# Altium project LimeSDR-Micro_1v1.PrjPcb (part 1 of 4)
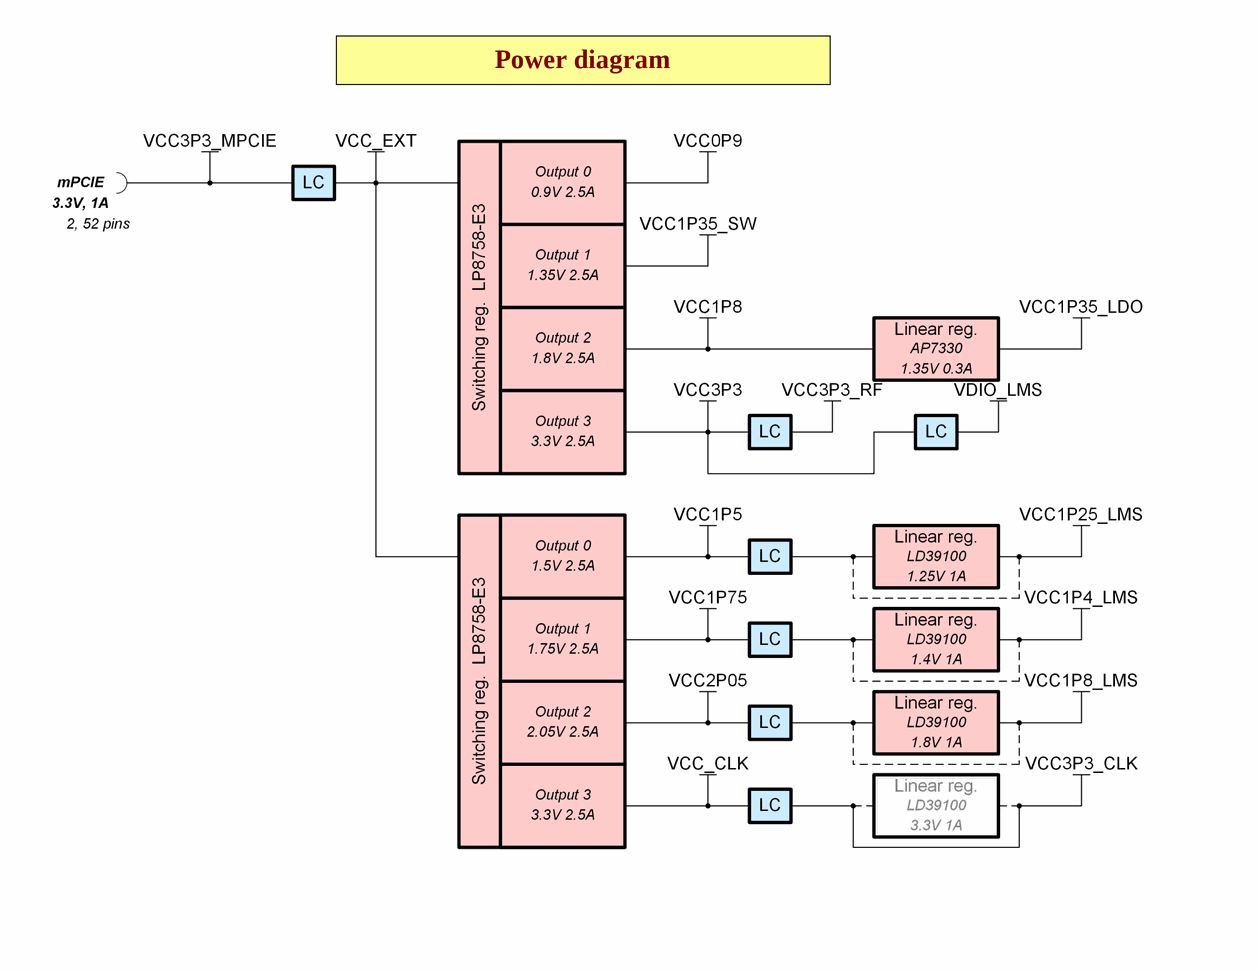
[diagram p0: 02_Power_Diagram.SchDoc, left]
3 sheets, 188 parts. Net scope: global (net labels, ports and power ports of the same name join across sheets).
Board file: LimeSDR-Micro_1v1.PcbDoc
Sheets:
  02_Power_Diagram.SchDoc
  09_Misc.SchDoc
  11_Power.SchDoc

## Sheet 02_Power_Diagram.SchDoc: Power diagram
size A4; Organization: Lime Microsystems; Address1: Surrey Tech Centre; Address2: Guildford GU2 7YG; Address3: Surrey; Address4: United Kingdom; Revision: v1.1; SheetNumber: 2; SheetTotal: 11

### Notes on the sheet
- Power diagram
- Project name:
- Title:
- Size:
- Date:
- A4
- Revision:
- Time:
- Sheet
- of
- File:

## Sheet 09_Misc.SchDoc: Misc
size A3; Organization: Lime Microsystems; Address1: Surrey Tech Centre; Address2: Guildford GU2 7YG; Address3: Surrey; Address4: United Kingdom; Revision: v1.1; SheetNumber: 9; SheetTotal: 11
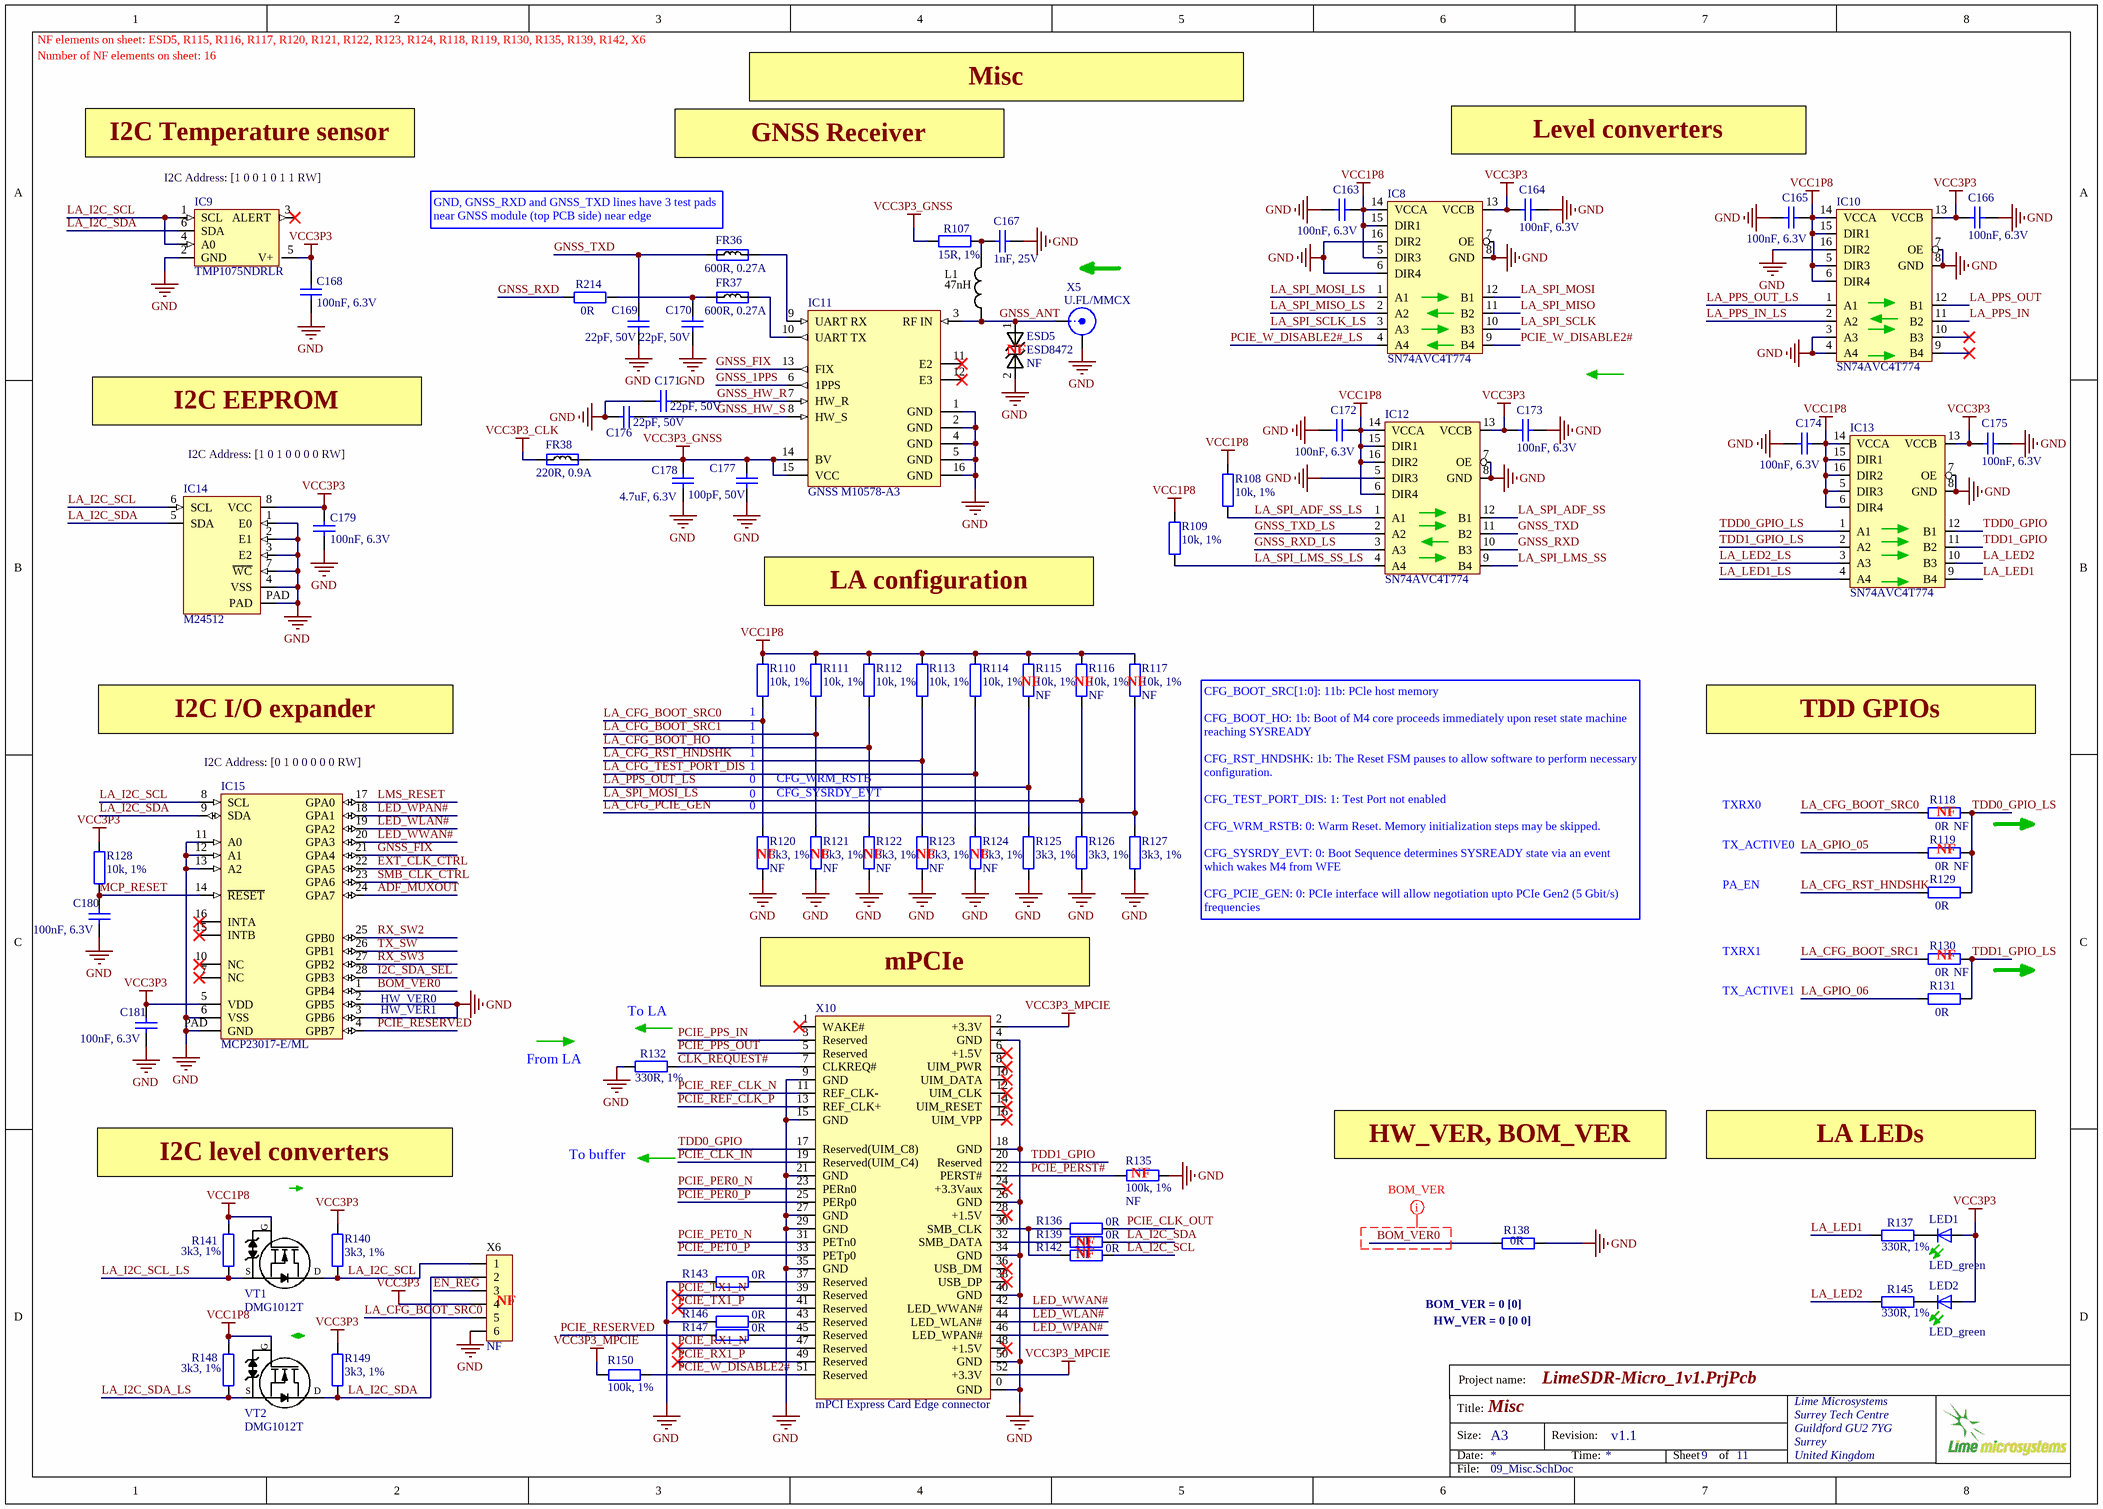
[diagram p1: 09_Misc.SchDoc]

### Parts
C163  100nF, 6.3V  [CAP0201]
C164  100nF, 6.3V  [CAP0201]
C165  100nF, 6.3V  [CAP0201]
C166  100nF, 6.3V  [CAP0201]
C167  1nF, 25V  [CAP0201]
C168  100nF, 6.3V  [CAP0201]
C169  22pF, 50V  [CAP0201]
C170  22pF, 50V  [CAP0201]
C171  22pF, 50V  [CAP0201]
C172  100nF, 6.3V  [CAP0201]
C173  100nF, 6.3V  [CAP0201]
C174  100nF, 6.3V  [CAP0201]
C175  100nF, 6.3V  [CAP0201]
C176  22pF, 50V  [CAP0201]
C177  100pF, 50V  [CAP0201]
C178  4.7uF, 6.3V  [CAP0402]
C179  100nF, 6.3V  [CAP0201]
C180  100nF, 6.3V  [CAP0201]
C181  100nF, 6.3V  [CAP0201]
ESD5  ESD8472  Assembly Info: NF  [ESD8472_X3DFN2]
FR36  600R, 0.27A  [RES0201]
FR37  600R, 0.27A  [RES0201]
FR38  220R, 0.9A  [RES0402]
IC8  SN74AVC4T774  [SN74AVC4T774_v1]
IC9  TMP1075NDRLR  [TMP1075NDRLR_temperature_sensor_SOT563]
IC10  SN74AVC4T774  [SN74AVC4T774_v1]
IC11  GNSS M10578-A3  [M10578-A3_v2]
IC12  SN74AVC4T774  [SN74AVC4T774_v1]
IC13  SN74AVC4T774  [SN74AVC4T774_v1]
IC14  M24512  [M24128-DFMC6TG]
IC15  MCP23017-E/ML  [MCP23017-E/ML_QFN28]
L1  47nH  [RES0402]
LED1  LED_green  [LED0201]
LED2  LED_green  [LED0201]
R107  15R, 1%  [RES0201]
R108  10k, 1%  [RES0201]
R109  10k, 1%  [RES0201]
R110  10k, 1%  [RES0201]
R111  10k, 1%  [RES0201]
R112  10k, 1%  [RES0201]
R113  10k, 1%  [RES0201]
R114  10k, 1%  [RES0201]
R115  10k, 1%  Assembly Info: NF  [RES0201]
R116  10k, 1%  Assembly Info: NF  [RES0201]
R117  10k, 1%  Assembly Info: NF  [RES0201]
R118  0R  Assembly Info: NF  [RES0201]
R119  0R  Assembly Info: NF  [RES0201]
R120  3k3, 1%  Assembly Info: NF  [RES0201]
R121  3k3, 1%  Assembly Info: NF  [RES0201]
R122  3k3, 1%  Assembly Info: NF  [RES0201]
R123  3k3, 1%  Assembly Info: NF  [RES0201]
R124  3k3, 1%  Assembly Info: NF  [RES0201]
R125  3k3, 1%  [RES0201]
R126  3k3, 1%  [RES0201]
R127  3k3, 1%  [RES0201]
R128  10k, 1%  [RES0201]
R129  0R  [RES0201]
R130  0R  Assembly Info: NF  [RES0201]
R131  0R  [RES0201]
R132  330R, 1%  [RES0201]
R135  100k, 1%  Assembly Info: NF  [RES0201]
R136  0R  [RES0201]
R137  330R, 1%  [RES0201]
R138  0R  [RES0201]
R139  0R  Assembly Info: NF  [RES0201]
R140  3k3, 1%  [RES0201]
R141  3k3, 1%  [RES0201]
R142  0R  Assembly Info: NF  [RES0201]
R143  0R  [RES0201]
R145  330R, 1%  [RES0201]
R146  0R  [RES0201]
R147  0R  [RES0201]
R148  3k3, 1%  [RES0201]
R149  3k3, 1%  [RES0201]
R150  100k, 1%  [RES0201]
R214  0R  [RES0201]
VT1  DMG1012T  [SOT523]
VT2  DMG1012T  [SOT523]
X5  U.FL/MMCX  [MMCX_UFL_conn_u_v2]
X6  Assembly Info: NF  [Molex_0788641001_spring_contacts]  (hidden comment: Molex 0788641001)
X10  mPCI Express Card Edge connector  [PCIe_MiniCard]  (no BOM)

### Nets
GND: C163.1 C164.2 C165.1 C166.2 C167.2 C168.2 C169.2 C170.2 C171.2 C172.1 C173.2 C174.1 C175.2 C176.2 C177.1 C178.1 C179.2 C180.2 C181.2 ESD5.2 IC8.6(DIR4) IC8.7(OE) IC8.8(GND) IC8.16(DIR2) IC9.2(GND) IC10.3(A3) IC10.4(A4) IC10.7(OE) IC10.8(GND) IC10.16(DIR2) IC11.1(GND) IC11.2(GND) IC11.4(GND) IC11.5(GND) IC11.16(GND) IC12.5(DIR3) IC12.7(OE) IC12.8(GND) IC13.7(OE) IC13.8(GND) IC14.1(E0) IC14.2(E1) IC14.3(E2) IC14.4(VSS) IC14.7(~{WC}) IC14.PAD IC15.2(GPB5) IC15.3(GPB6) IC15.6(VSS) IC15.11(A0) IC15.12(A1) IC15.13(A2) IC15.PAD(GND) R120.2 R121.2 R122.2 R123.2 R124.2 R125.2 R126.2 R127.2 R132.2 R135.1 R138.2 R143.1 R146.1 X5.2(Y) X6.6 X10.0(GND) X10.4(GND) X10.9(GND) X10.15(GND) X10.18(GND) X10.21(GND) X10.26(GND) X10.27(GND) X10.29(GND) X10.34(GND) X10.35(GND) X10.40(GND) X10.50(GND)
VCC1P8: C163.2 C165.2 C172.2 C174.2 IC8.5(DIR3) IC8.14(VCCA) IC8.15(DIR1) IC10.5(DIR3) IC10.6(DIR4) IC10.14(VCCA) IC10.15(DIR1) IC12.6(DIR4) IC12.14(VCCA) IC12.15(DIR1) IC12.16(DIR2) IC13.5(DIR3) IC13.6(DIR4) IC13.14(VCCA) IC13.15(DIR1) IC13.16(DIR2) R108.1 R109.1 R110.1 R111.1 R112.1 R113.1 R114.1 R115.1 R116.1 R117.1 R141.1 R148.1 VT1.G VT2.G
VCC3P3: C164.1 C166.1 C168.1 C173.1 C175.1 C179.1 C181.1 IC8.13(VCCB) IC9.5(V+) IC10.13(VCCB) IC12.13(VCCB) IC13.13(VCCB) IC14.8(VCC) IC15.5(VDD) LED1.A LED2.A R128.1 R140.1 R149.1 X6.4
VCC3P3_CLK: FR38.1
VCC3P3_GNSS: C177.2 C178.2 FR38.2 IC11.14(BV) IC11.15(VCC) R107.2
VCC3P3_MPCIE: R150.2 X10.2(+3.3V) X10.52(+3.3V)
ADF_MUXOUT: IC15.24(GPA7)
BOM_VER0: IC15.1(GPB4) R138.1
CLK_REQUEST#: R132.1 X10.7(CLKREQ#)
EN_REG: X6.3
EXT_CLK_CTRL: IC15.22(GPA5)
GNSS_1PPS: IC11.6(1PPS)
GNSS_ANT: ESD5.1 IC11.3(RF_IN) L1.1 X5.1(X)
GNSS_FIX: IC11.13(FIX) IC15.21(GPA4)
GNSS_HW_R: C171.1 IC11.7(HW_R)
GNSS_HW_S: C176.1 IC11.8(HW_S)
GNSS_RXD: IC12.10(B3) R214.1
GNSS_RXD_LS: IC12.3(A3)
GNSS_TXD: C169.1 FR36.1 IC12.11(B2)
GNSS_TXD_LS: IC12.2(A2)
I2C_SDA_SEL: IC15.28(GPB3)
LA_CFG_BOOT_HO: R112.2 R122.1
LA_CFG_BOOT_SRC0: R110.2 R118.1 R120.1 X6.5
LA_CFG_BOOT_SRC1: R111.2 R121.1 R130.1
LA_CFG_PCIE_GEN: R117.2 R127.1
LA_CFG_RST_HNDSHK: R113.2 R123.1 R129.1
LA_CFG_TEST_PORT_DIS: R114.2 R124.1
LA_GPIO_05: R119.1
LA_GPIO_06: R131.1
LA_I2C_SCL: IC9.1(SCL) IC9.4(A0) IC14.6(SCL) IC15.8(SCL) R140.2 R142.2 VT1.D X6.1
LA_I2C_SCL_LS: R141.2 VT1.S
LA_I2C_SDA: IC9.6(SDA) IC14.5(SDA) IC15.9(SDA) R139.2 R149.2 VT2.D X6.2
LA_I2C_SDA_LS: R148.2 VT2.S
LA_LED1: IC13.9(B4) R137.2
LA_LED1_LS: IC13.4(A4)
LA_LED2: IC13.10(B3) R145.2
LA_LED2_LS: IC13.3(A3)
LA_PPS_IN: IC10.11(B2)
LA_PPS_IN_LS: IC10.2(A2)
LA_PPS_OUT: IC10.12(B1)
LA_PPS_OUT_LS: IC10.1(A1) R115.2 R125.1
LA_SPI_ADF_SS: IC12.12(B1)
LA_SPI_ADF_SS_LS: IC12.1(A1) R108.2
LA_SPI_LMS_SS: IC12.9(B4)
LA_SPI_LMS_SS_LS: IC12.4(A4) R109.2
LA_SPI_MISO: IC8.11(B2)
LA_SPI_MISO_LS: IC8.2(A2)
LA_SPI_MOSI: IC8.12(B1)
LA_SPI_MOSI_LS: IC8.1(A1) R116.2 R126.1
LA_SPI_SCLK: IC8.10(B3)
LA_SPI_SCLK_LS: IC8.3(A3)
LED_WLAN#: IC15.19(GPA2) X10.44(LED_WLAN#)
LED_WPAN#: IC15.18(GPA1) X10.46(LED_WPAN#)
LED_WWAN#: IC15.20(GPA3) X10.42(LED_WWAN#)
LMS_RESET: IC15.17(GPA0)
MCP_RESET: C180.1 IC15.14(~{RESET}) R128.2
PCIE_CLK_IN: X10.19(Reserved(UIM_C4))
PCIE_CLK_OUT: R136.2
PCIE_PER0_N: X10.23(PERn0)
PCIE_PER0_P: X10.25(PERp0)
PCIE_PERST#: R135.2 X10.22(PERST#)
PCIE_PET0_N: X10.31(PETn0)
PCIE_PET0_P: X10.33(PETp0)
PCIE_PPS_IN: X10.3(Reserved)
PCIE_PPS_OUT: X10.5(Reserved)
PCIE_REF_CLK_N: X10.11(REF_CLK-)
PCIE_REF_CLK_P: X10.13(REF_CLK+)
PCIE_RESERVED: IC15.4(GPB7) R147.1
PCIE_RX1_N: X10.47(Reserved)
PCIE_RX1_P: X10.49(Reserved)
PCIE_TX1_N: X10.39(Reserved)
PCIE_TX1_P: X10.41(Reserved)
PCIE_W_DISABLE2#: IC8.9(B4) R150.1 X10.51(Reserved)
PCIE_W_DISABLE2#_LS: IC8.4(A4)
RX_SW2: IC15.25(GPB0)
RX_SW3: IC15.27(GPB2)
SMB_CLK_CTRL: IC15.23(GPA6)
TDD0_GPIO: IC13.12(B1) X10.17(Reserved(UIM_C8))
TDD0_GPIO_LS: IC13.1(A1) R118.2 R119.2 R129.2
TDD1_GPIO: IC13.11(B2) X10.20(Reserved)
TDD1_GPIO_LS: IC13.2(A2) R130.2 R131.2
TX_SW: IC15.26(GPB1)
NetC167_1: C167.1 L1.2 R107.1
NetC170_1: C170.1 FR37.1 R214.2
NetFR36_2: FR36.2 IC11.9(UART_RX)
NetFR37_2: FR37.2 IC11.10(UART_TX)
NetLED1_K: LED1.K(C) R137.1
NetLED2_K: LED2.K(C) R145.1
NetR136_1: R136.1 R142.1 X10.30(SMB_CLK)
NetR139_1: R139.1 X10.32(SMB_DATA)
NetR143_2: R143.2 X10.37(Reserved)
NetR146_2: R146.2 X10.43(Reserved)
NetR147_2: R147.2 X10.45(Reserved)

Not connected (* = marked no-connect by the designer): IC9 3(ALERT)*; IC10 9(B4)* 10(B3)*; IC11 11(E2)* 12(E3)*; IC15 7(NC)* 10(NC)* 15(INTB)* 16(INTA)*; X10 1(WAKE#)* 6(+1.5V)* 8(UIM_PWR)* 10(UIM_DATA)* 12(UIM_CLK)* 14(UIM_RESET)* 16(UIM_VPP)* 24(+3.3Vaux)* 28(+1.5V)* 36(USB_DM)* 38(USB_DP)* 48(+1.5V)*

### Layout directives
net class BOM_VER: BOM_VER0

### Notes on the sheet
- NF elements on sheet: ESD5, R115, R116, R117, R120, R121, R122, R123, R124, R118, R119, R130, R135, R139, R142, X6
- Number of NF elements on sheet: 16
- Misc
- I2C Temperature sensor
- (near IC9) I2C Address: [1 0 0 1 0 1 1 RW]
- GNSS Receiver
- Level converters
- (near FR36) GND, GNSS_RXD and GNSS_TXD lines have 3 test pads near GNSS module (top PCB side) near edge
- (near ESD5) NF
- I2C EEPROM
- I2C Address: [1 0 1 0 0 0 0 RW]
- LA configuration
- (near R110) 1
- (near R115) NF
- (near R116) NF
- (near R117) NF
- I2C I/O expander
- (near IC15) I2C Address: [0 1 0 0 0 0 0 RW]
- 1
- 0
- CFG_WRM_RSTB
- TDD GPIOs
- (near R120) 0
- CFG_SYSRDY_EVT
- TXRX0
- TX_ACTIVE0
- (near R118) NF
- (near R119) NF
- (near R120) NF
- (near R121) NF
- (near R122) NF
- (near R123) NF
- (near R124) NF
- CFG_BOOT_SRC[1:0]: 11b: PCle host memory
  CFG_BOOT_HO: 1b: Boot of M4 core proceeds immediately upon reset state machine reaching SYSREADY
  CFG_RST_HNDSHK: 1b: The Reset FSM pauses to allow software to perform necessary configuration.
  CFG_TEST_PORT_DIS: 1: Test Port not enabled
  CFG_WRM_RSTB: 0: Warm Reset. Memory initialization steps may be skipped.
  CFG_SYSRDY_EVT: 0: Boot Sequence determines SYSREADY state via an event which wakes M4 from WFE
  CFG_PCIE_GEN: 0: PCIe interface will allow negotiation upto PCIe Gen2 (5 Gbit/s) frequencies
- PA_EN
- (near X10) mPCIe
- TXRX1
- (near R130) NF
- (near IC15) HW_VER0
- (near IC15) HW_VER1
- (near R132) To LA
- TX_ACTIVE1
- From LA
- I2C level converters
- To buffer
- (near R135) NF
- HW_VER, BOM_VER
- LA LEDs
- NF
- (near X6) NF
- BOM_VER = 0 [0]
- HW_VER = 0 [0 0]
- Project name:
- Title:
- Size:
- Date:
- A3
- Revision:
- Time:
- Sheet
- of
- File:

### Library data of the parts
C163-C166 C168 C172-C175 C179-C181 = Cap_0402: Part Description: 0.1 µF ±20% 10V Ceramic Capacitor X5R 0201 (0603 Metric); Manufacturer: Samsung; Manufacturer Part Number 1: CL03A104MP3NNNC; Tolerance: 20%; Voltage Rating (DC): 10V; Value: 100nF, 6.3V; Capacitance: 100nF; Case/Package: 0201; Case Code (Imperial): 0201; Case Code (Metric): 0603; ComponentLink5Description: https://datasheet.ciiva.com/25788/cl03a104mp3nnnc-25788272.pdf?src-supplier=Digi-Key; ComponentLink5URL: https://datasheet.ciiva.com/25788/cl03a104mp3nnnc-25788272.pdf?src-supplier=Digi-Key; Length: 0.024inch; Max Operating Temperature: 85°C; Min Operating Temperature: -55°C; Mount: Surface Mount; Package Quantity: 1; Packaging: Tape and Reel; Pricing 1: 1=0,10000, 10=0,03000, 50=0,01640, 100=0,01330, 500=0,00950, 1000=0,00747, 2500=0,00679, 5000=0,00625 (USD); RoHS: Yes; RoHS Compliant: Yes; Series: CL; Stock 1: 3817176; Supplier 1: Digi-Key; Supplier Part Number 1: 1276-1321-1-ND; Thickness: 0.013inch; Voltage Rating: 10V; Width: 0.012inch
C167 = Cap_0402: Manufacturer Part Number 1: C0603X7R1E102K030BA; Manufacturer: TDK Corporation; Part Description: 1000pF ±10% 25V X7R Ceramic Capacitor -55°C ~ 125°C Surface Mount, MLCC 0201 (0603 Metric) 0.024" L x 0.012" W (0.60mm x 0.30mm); Temperature Coefficient: X7R; Tolerance: ±10%; Capacitance: 1000pF; Value: 1nF, 25V; Supplier 1: Digi-Key; Supplier Part Number 1: 445-7275-1-ND; Voltage - Rated: 25V; Features: -; Package / Case: 0201 (0603 Metric); Lead Spacing: -; Mounting Type: Surface Mount, MLCC; Lead Style: -; Height - Seated (Max): -; Operating Temperature: -55°C ~ 125°C; Size / Dimension: 0.024" L x 0.012" W (0.60mm x 0.30mm); Applications: General Purpose; Ratings: -; Thickness (Max): 0.013" (0.33mm); RoHS: RoHS Compliant; Packaging: Cut Tape (CT); Category: Capacitors
C169-C171 C176 = Cap_0402: Manufacturer: Murata; Manufacturer Part Number 1: GRM0335C1H220JA01D; Part Description: 22 pF ±5% 50V Ceramic Capacitor C0G, NP0 0201 (0603 Metric); Tolerance: 5%; Dielectric: C0G; Value: 22pF, 50V; Supplier 1: Digi-Key; Supplier Part Number 1: 490-6123-1-ND; Stock 1: 2966748; Pricing 1: 1=0,10000, 10=0,01300, 50=0,00720, 100=0,00590, 500=0,00424, 1000=0,00333, 2500=0,00303, 5000=0,00279 (USD); RoHS: Yes; Mount: Surface Mount; Case/Package: 0201; Case Code (Metric): 0603; Case Code (Imperial): 0201; Min Operating Temperature: -55°C; Max Operating Temperature: 125°C; Package Quantity: 15000; Capacitance: 22pF; Voltage Rating: 50V; Packaging: Tape and Reel; Termination: SMD/SMT; Voltage: 50V; Voltage Rating (DC): 50V; Series: GRM; Length: 0.6mm; Width: 0.012inch; Height: 0.3mm; Thickness: 0.013inch; Depth: 0.3mm; Lead Free: Lead Free; RoHS Compliant: Yes; ComponentLink1URL: https://datasheet.ciiva.com/6271/partnumbering-e-01-6271146.pdf?src-supplier=Digi-Key; ComponentLink1Description: https://datasheet.ciiva.com/6271/partnumbering-e-01-6271146.pdf?src-supplier=Digi-Key; ComponentLink2URL: https://datasheet.ciiva.com/6271/partnumbering-e-01-6271143.pdf?src-supplier=Digi-Key; ComponentLink2Description: https://datasheet.ciiva.com/6271/partnumbering-e-01-6271143.pdf?src-supplier=Digi-Key; ComponentLink3URL: https://datasheet.ciiva.com/6271/partnumbering-e-01-6271149.pdf?src-supplier=Digi-Key; ComponentLink3Description: https://datasheet.ciiva.com/6271/partnumbering-e-01-6271149.pdf?src-supplier=Digi-Key
C177 = Cap_0402: Part Description: 100 pF ±5% 50V Ceramic Capacitor C0G, NP0 0201 (0603 Metric); Manufacturer: TDK; Manufacturer Part Number 1: C0603C0G1H101J030BA; Dielectric: C0G; Dielectric Material: Ceramic; Insulation Resistance: 10GR; Tolerance: 5%; Value: 100pF, 50V; Capacitance: 100pF; Case/Package: 0201; Case Code (Imperial): 0201; Case Code (Metric): 0603; ComponentLink1Description: https://datasheet.ciiva.com/24217/c0603c0g1h101j030ba-264106-24217425.pdf?src-supplier=Mouser; ComponentLink1URL: https://datasheet.ciiva.com/24217/c0603c0g1h101j030ba-264106-24217425.pdf?src-supplier=Mouser; ComponentLink2Description: https://datasheet.ciiva.com/16205/mlcc-commercial-general-en-16205590.pdf?src-supplier=Future+Electronics; ComponentLink2URL: https://datasheet.ciiva.com/16205/mlcc-commercial-general-en-16205590.pdf?src-supplier=Future+Electronics; ComponentLink3Description: https://datasheet.ciiva.com/6250/tdkmlcccaprange-6250351.pdf?src-supplier=Digi-Key; ComponentLink3URL: https://datasheet.ciiva.com/6250/tdkmlcccaprange-6250351.pdf?src-supplier=Digi-Key; Construction: Flat; Depth: 0.3mm; Height: 0.3mm; Lead Free: Lead Free; Length: 0.6mm; Max Operating Temperature: 125°C; Min Operating Temperature: -55°C; Mount: Surface Mount; Number of Pins: 2; Package Quantity: 1; Packaging: Tape and Reel; Pricing 1: 1=0,10000, 10=0,06000, 50=0,03280, 100=0,02670, 500=0,01908, 1000=0,01500, 2500=0,01364, 5000=0,01254 (USD); Reach SVHC Compliant: Yes; RoHS: Yes; RoHS Compliant: Yes; Series: C; Stock 1: 367528; Supplier 1: Digi-Key; Supplier Part Number 1: 445-1786-1-ND; Termination: SMD/SMT; Thickness: 0.013inch; Voltage: 50V; Voltage Rating (DC): 50V; Voltage Rating: 50V; Weight: 6E-06oz; Width: 0.012inch
C178 = Cap_0402: Manufacturer: Murata Electronics North America; Manufacturer Part Number 1: GRM155R60J475ME87D; Part Description: 4.7µF ±20% 6.3V X5R Ceramic Capacitor -55°C ~ 85°C Surface Mount, MLCC 0402 (1005 Metric) 0.039" L x 0.020" W (1.00mm x 0.50mm); Tolerance: ±20%; Capacitance: 4.7µF; Temperature Coefficient: X5R; Lead Style: -; Ratings: -; Height - Seated (Max): -; Thickness (Max): 0.022" (0.55mm); Voltage - Rated: 6.3V; Packaging: Cut Tape (CT); Lead Spacing: -; Category: Capacitors; Supplier Part Number 1: 490-5408-1-ND; Applications: General Purpose; Operating Temperature: -55°C ~ 85°C; Mounting Type: Surface Mount, MLCC; Features: Derating Recommended; RoHS: RoHS Compliant; Supplier 1: Digi-Key; Package / Case: 0402 (1005 Metric); Size / Dimension: 0.039" L x 0.020" W (1.00mm x 0.50mm); Value: 4.7uF, 6.3V
ESD5 = ESD8472: Manufacturer: ON Semiconductor; Manufacturer Part Number 1: ESD8472MUT5G; Part Description: TVS DIODE 5.3VWM 14VC X3DFN2; Voltage - Reverse Standoff (Typ): 5.3V (Max); Voltage - Breakdown (Min): 7V; Voltage - Clamping (Max) @ Ipp: 14V; Current - Peak Pulse (10/1000µs): 3A (8/20µs); Power Line Protection: No; Capacitance @ Frequency: 0.2pF @ 1MHz; Supplier 1: Digi-Key; RoHS: RoHS Compliant; Category: Circuit Protection; Stock 1: 2295; Pricing 1: 1=0.39, 10=0.315, 100=0.2142, 500=0.16068, 1000=0.12051 (USD); Packaging: Cut Tape (CT); Part Status: Active; Type: Zener; Power - Peak Pulse: -; Applications: Automotive, RF Antenna; Operating Temperature: -55°C ~ 150°C (TJ); Mounting Type: Surface Mount; Package / Case: 2-XFDFN; Supplier Device Package: 2-X3DFN (0.62x0.32); ComponentLink1URL: http://www.onsemi.com/pub/Collateral/ESD8472-D.PDF; ComponentLink1Description: http://www.onsemi.com/pub/Collateral/ESD8472-D.PDF; Supplier Part Number 1: ESD8472MUT5GOSCT-ND
FR36 FR37 = Ferrite: Manufacturer Part Number 1: BK0603TS601-T; Manufacturer: Taiyo Yuden; Part Description: FERRITE BEAD 600 OHM 0201 1LN; DC Resistance (DCR): 750 mOhm Max; Filter Type: Differential Mode - Single; Impedance @ Frequency: 600 Ohm @ 100MHz; Current Rating: 270mA; Value: 600R@100MHz; Supplier 1: Digi-Key; Supplier Part Number 1: 587-3277-1-ND; Size / Dimension: 0.024" L x 0.012" W (0.60mm x 0.30mm); Package / Case: 0201 (0603 Metric); Height (Max): 0.013" (0.33mm); Mounting Type: Surface Mount; Packaging: Cut Tape (CT); RoHS: RoHS Compliant; Category: Filters
FR38 = Ferrite: Manufacturer: TDK Corporation; Manufacturer Part Number 1: MPZ1005S221ET000; Part Description: FERRITE BEAD 220 OHM 0402 1LN; Impedance @ Frequency: 220 Ohm @ 100MHz; Current Rating: 900mA; DC Resistance (DCR): 220 mOhm Max; Supplier 1: Digi-Key; Package / Case: 0402 (1005 Metric); Category: Filters; Supplier Part Number 1: 445-9329-2-ND; Value: 220R, 0.9A
IC8 IC10 IC12 IC13 = SN74AVC4T774: Manufacturer: Texas Instruments; Manufacturer Part Number 1: SN74AVC4T774RSVR; Part Description: Voltage Level Translator Bidirectional 1 Circuit 4 Channel 380Mbps 16-UQFN (2.6x1.8); Logic Function: Translator, Bidirectional, 3-State; Differential - Input:Output: No/No; Propagation Delay (Max): 2.4ns; Number of Bits: 4; Number of Outputs/Channel: 1; Input Type: Logic; Voltage - Supply: 1.2 V ~ 3.6 V; Data Rate: 380Mbps; Supplier 1: Digi-Key; Supplier Device Package: 16-UQFN (2.6x1.8); Packaging: Digi-Reel®; Category: Integrated Circuits (ICs); Mounting Type: Surface Mount; RoHS: RoHS Compliant; Number of Channels: 4; Output Type: Logic; Package / Case: 16-UFQFN; Operating Temperature: -40°C ~ 85°C; Supplier Part Number 1: 296-24741-6-ND
IC9 = TMP1075NDRLR_temperature_sensor: Part Description: Temperature Sensor Digital, Local -40°C ~ 125°C 12 b SOT-563; Manufacturer: Texas Instruments; Supplier 1: Digi-Key; Supplier Part Number 1: 296-TMP1075NDRLRCT-ND; Manufacturer Part Number 1: TMP1075NDRLR; Stock 1: 3405; Pricing 1: 1=0,67000, 5=0,63800, 10=0,55500, 25=0,48760, 50=0,40500, 100=0,34500, 500=0,30000, 1000=0,26250 (USD); RoHS: No; RoHS Compliant: Yes
IC11 = M10578-A3_GPS_GNSS: Manufacturer: Antenova; Part Description: RADIONOVA RF Receiver GPS 1.575GHz -165dBm Module; Frequency: 1.575GHz; Sensitivity: -165dBm; Modulation or Protocol: GPS; Current - Receiving: 28mA; Data Interface: UART; Voltage - Supply: 3.3V; Supplier 1: Digi-Key; Manufacturer Part Number 1: M10578-A3; RoHS: RoHS Compliant; Category: RF/IF and RFID; Stock 1: 0; Pricing 1: 1=17.75, 10=16.061, 25=14.7928, 100=13.5248, 250=12.67952, 500=11.8342 (USD); Packaging: Cut Tape (CT); Part Status: Active; Data Rate (Max): -; Applications: General Purpose; Memory Size: -; Antenna Connector: -; Features: -; Operating Temperature: -40°C ~ 85°C; Package / Case: Module; Supplier Device Package: Module; ComponentLink1URL: http://www.antenova-m2m.com/wp-content/uploads/2015/12/GPS_Radionova_M10578-A3-PS-1.0.pdf; ComponentLink1Description: http://www.antenova-m2m.com/wp-content/uploads/2015/12/GPS_Radionova_M10578-A3-PS-1.0.pdf; Supplier Part Number 1: 627-1074-1-ND
IC14 = M24128-DFMC6TG: Part Description: IC EEPROM 512KBIT I2C 8UFDFPN; Manufacturer: STMicroelectronics; Manufacturer Part Number 1: M24512-DFMC6TG; ComponentLink1URL: http://www.st.com/content/ccc/resource/technical/document/datasheet/59/05/c9/5b/7b/41/48/b6/CD00259167.pdf/files/CD00259167.pdf/jcr:content/translations/en.CD00259167.pdf; ComponentLink1Description: http://www.st.com/content/ccc/resource/technical/document/datasheet/59/05/c9/5b/7b/41/48/b6/CD00259167.pdf/files/CD00259167.pdf/jcr:content/translations/en.CD00259167.pdf; Supplier 1: Digi-Key; Supplier Part Number 1: 497-15745-1-ND; Stock 1: 12789; Pricing 1: 1=1,03, 10=0,935, 25=0,9232, 50=0,9178, 100=0,8206, 250=0,81368, 500=0,80166, 1000=0,77298 (USD); RoHS: Yes; ComponentLink2URL: https://datasheet.ciiva.com/29611/cd00251873-29611552.pdf?src-supplier=Digi-Key; ComponentLink2Description: https://datasheet.ciiva.com/29611/cd00251873-29611552.pdf?src-supplier=Digi-Key
IC15 = MCP23017-E/ML_I2C_expander: Part Description: I/O Expander 16 I²C 1.7 MHz 28-QFN (6x6); Manufacturer: Microchip; ComponentLink1URL: https://datasheet.ciiva.com/1496/12179-1496011.pdf?src-supplier=Element14; ComponentLink1Description: https://datasheet.ciiva.com/1496/12179-1496011.pdf?src-supplier=Element14; ComponentLink2URL: https://datasheet.ciiva.com/1780/21952b-1780121.pdf?src-supplier=Digi-Key; ComponentLink2Description: https://datasheet.ciiva.com/1780/21952b-1780121.pdf?src-supplier=Digi-Key; ComponentLink3URL: https://datasheet.ciiva.com/3149/21952b-3149158.pdf?src-supplier=Avnet; ComponentLink3Description: https://datasheet.ciiva.com/3149/21952b-3149158.pdf?src-supplier=Avnet; ComponentLink4URL: https://datasheet.ciiva.com/16222/filehandler-aspxddocname-en023709-16222331.pdf?src-supplier=Future+Electronics; ComponentLink4Description: https://datasheet.ciiva.com/16222/filehandler-aspxddocname-en023709-16222331.pdf?src-supplier=Future+Electronics; Supplier 1: Digi-Key; Supplier Part Number 1: MCP23017-E/ML-ND; Manufacturer Part Number 1: MCP23017-E/ML; Stock 1: 3965; Pricing 1: 1=1,9, 25=1,59, 100=1,44 (USD); RoHS: Yes
L1 = Inductor_0603: Manufacturer: COILCRAFT; Manufacturer Part Number: 0402HP-47NXJLU; Part Description: INDUCTOR, RF, 47NH, 5%, 2.4GHZ, SMD; Product Range:0402HP Series; Inductance:47nH; Inductance Tolerance:± 5%; High Frequency Inductor Case:0402 [1005 Metric]; Self Resonant Frequency Min:2.4GHz; DC Resistance Max:0.58ohm; DC Current Rating:420mA; SVHC: No SVHC (15-Jun-2015); Inductance Tolerance: ± 5%; High Frequency Inductor Case: 0402 [1005 Metric]; Inductance: 47; DC Resistance Max: 0.58; Self Resonant Frequency Min: 2.4; Product Range: 0402; DC Current Rating: 420; Inductor Construction: Wirewound; Supplier 1: Farnell; Supplier Part Number 1: 2285856; Packaging: Cut Tape; Inductor Case Style: 0402 [1005 Metric]; RoHS: Y-EX; value: 47nH; Manufacturer Part Number 1: 0402HP-47NXJLU
LED1 LED2 = LED_green: Part Description: Green 571nm LED Indication - Discrete 1.97V 2-SMD, 0201; Manufacturer: Kingbright; Manufacturer Part Number 1: APG0603CGC-TT; Color: Green; Lens Color: Colorless; Lens Transparency: Clear; Luminous Intensity: 15mcd; Test Current: 10mA; Viewing Angle: 140°; Dominant Wavelength: 571nm; Forward Voltage: 1.97V; ComponentLink1URL: http://www.kingbrightusa.com/images/catalog/SPEC/APG0603CGC-TT.pdf?src-supplier=Digi-Key; ComponentLink1Description: http://www.kingbrightusa.com/images/catalog/SPEC/APG0603CGC-TT.pdf?src-supplier=Digi-Key; Supplier 1: Digi-Key; Supplier Part Number 1: 754-2021-1-ND; Stock 1: 18826; Pricing 1: 1=0,50000, 10=0,30500, 100=0,17530, 1000=0,13720, 2000=0,12577 (USD); RoHS: Yes; Mount: Surface Mount; Case/Package: SMD/SMT; Packaging: Tape and Reel; Length: 0.65mm; Width: 0.35mm; Height: 0.25mm; Lead Free: Lead Free; RoHS Compliant: Yes
R107 = Res_0402: Manufacturer: Yageo; Manufacturer Part Number 1: RC0201FR-0715RL; Part Description: 15 Ohms ±1% 0.05W, 1/20W Chip Resistor 0201 (0603 Metric) Moisture Resistant Thick Film; Power Rating: 50mW; Voltage Rating: 25V; Temperature Coefficient: 200ppm/°C; Value: 15R, 1%; ComponentLink1URL: https://datasheet.ciiva.com/5924/1563626-5924912.pdf?src-supplier=Farnell; ComponentLink1Description: https://datasheet.ciiva.com/5924/1563626-5924912.pdf?src-supplier=Farnell; ComponentLink2URL: https://datasheet.ciiva.com/22661/1563626-22661319.pdf?src-supplier=Element14; ComponentLink2Description: https://datasheet.ciiva.com/22661/1563626-22661319.pdf?src-supplier=Element14; Supplier 1: Digi-Key; Supplier Part Number 1: 311-15.0MCT-ND; Stock 1: 379739; Pricing 1: 1=0,10000, 10=0,03700, 100=0,01530, 1000=0,00685, 2500=0,00595, 5000=0,00491 (USD); RoHS: Yes; Case/Package: 0201; Case Code (Imperial): 0201; Case Code (Metric): 0603; Size Code: 0201; Min Operating Temperature: -55°C; Max Operating Temperature: 125°C; Resistance: 15R; Tolerance: 1%; Packaging: Cut Tape; Package Quantity: 1; Termination: SMD/SMT; Resistor Type: Thick Film; Number of Terminations: 2; Max Power Dissipation: 50mW; Features: Moisture Resistant; Series: RC; Resistance Tolerance: 1%; Length: 0.6mm; Width: 0.3mm; Height: 0.23mm; Lead Free: Lead Free; RoHS Compliant: Yes; ComponentLink3URL: https://datasheet.ciiva.com/7672/1563626-7672202.pdf?src-supplier=Element14; ComponentLink3Description: https://datasheet.ciiva.com/7672/1563626-7672202.pdf?src-supplier=Element14; ComponentLink4URL: https://datasheet.ciiva.com/2493/pyu-r-int-thick-7-2493785.pdf?src-supplier=Digi-Key; ComponentLink4Description: https://datasheet.ciiva.com/2493/pyu-r-int-thick-7-2493785.pdf?src-supplier=Digi-Key; ComponentLink5URL: https://datasheet.ciiva.com/2493/pyu-r-int-thick-7-2493786.pdf?src-supplier=Digi-Key; ComponentLink5Description: https://datasheet.ciiva.com/2493/pyu-r-int-thick-7-2493786.pdf?src-supplier=Digi-Key; ComponentLink6URL: https://datasheet.ciiva.com/2493/pyu-r-int-thick-7-2493784.pdf?src-supplier=Digi-Key; ComponentLink6Description: https://datasheet.ciiva.com/2493/pyu-r-int-thick-7-2493784.pdf?src-supplier=Digi-Key
R108-R117 R128 = Res_0402: Manufacturer: Yageo; Manufacturer Part Number 1: RC0201FR-0710KL; Part Description: 10 kOhms ±1% 0.05W, 1/20W Chip Resistor 0201 (0603 Metric) Moisture Resistant Thick Film; Resistance: 10kR; Power Rating: 50mW; Voltage Rating: 25V; Temperature Coefficient: 200ppm/°C; Value: 10k, 1%; ComponentLink1URL: https://datasheet.ciiva.com/5924/1563626-5924912.pdf?src-supplier=Farnell; ComponentLink1Description: https://datasheet.ciiva.com/5924/1563626-5924912.pdf?src-supplier=Farnell; ComponentLink2URL: https://datasheet.ciiva.com/22661/1563626-22661319.pdf?src-supplier=Element14; ComponentLink2Description: https://datasheet.ciiva.com/22661/1563626-22661319.pdf?src-supplier=Element14; Supplier 1: Digi-Key; Supplier Part Number 1: 311-10.0KMCT-ND; Stock 1: 17142315; Pricing 1: 1=0,10000, 10=0,03700, 100=0,01530, 1000=0,00685, 2500=0,00595, 5000=0,00491 (USD); RoHS: Yes; Case/Package: 0201; Number of Pins: 2; Case Code (Imperial): 0201; Case Code (Metric): 0603; Contact Plating: Tin,Matte; Weight: 6E-06oz; Min Operating Temperature: -55°C; Max Operating Temperature: 125°C; Tolerance: 1%; Packaging: Tape and Reel; Package Quantity: 10000; Termination: SMD/SMT; Resistor Type: Thick Film; Number of Terminations: 2; Max Power Dissipation: 50mW; Voltage Rating (DC): 25V; Features: Moisture Resistant; Series: RC; Resistance Tolerance: 1%; Construction: Rectangular; Working Voltage: 25V; Technology: THICK FILM; Length: 0.6mm; Width: 0.012inch; Height: 0.01inch; Depth: 0.3mm; Radiation Hardening: No; Reach SVHC Compliant: Yes; Military Standard: Not; Lead Free: Lead Free; RoHS Compliant: Yes; ComponentLink3URL: https://datasheet.ciiva.com/7660/1421516-7660807.pdf?src-supplier=Element14; ComponentLink3Description: https://datasheet.ciiva.com/7660/1421516-7660807.pdf?src-supplier=Element14; ComponentLink4URL: https://datasheet.ciiva.com/46391/1421516-46391339.pdf?src-supplier=Element14; ComponentLink4Description: https://datasheet.ciiva.com/46391/1421516-46391339.pdf?src-supplier=Element14; ComponentLink5URL: https://datasheet.ciiva.com/2467/pyu-r-int-thick-7-2467110.pdf?src-supplier=Digi-Key; ComponentLink5Description: https://datasheet.ciiva.com/2467/pyu-r-int-thick-7-2467110.pdf?src-supplier=Digi-Key; ComponentLink6URL: https://datasheet.ciiva.com/2467/pyu-r-int-thick-7-2467111.pdf?src-supplier=Digi-Key; ComponentLink6Description: https://datasheet.ciiva.com/2467/pyu-r-int-thick-7-2467111.pdf?src-supplier=Digi-Key; ComponentLink7URL: https://datasheet.ciiva.com/2467/pyu-r-int-thick-7-2467109.pdf?src-supplier=Digi-Key; ComponentLink7Description: https://datasheet.ciiva.com/2467/pyu-r-int-thick-7-2467109.pdf?src-supplier=Digi-Key
R118 R119 R129-R131 R136 R138 R139 R142 R143 R146 R147 R214 = Res_0402: Part Description: 0 Ohms Jumper Chip Resistor 0201 (0603 Metric) Moisture Resistant Thick Film; Manufacturer: Yageo; Manufacturer Part Number 1: RC0201JR-070RL; Power Rating: 50mW; Tolerance: 5%; Voltage Rating: 25V; ComponentLink1URL: http://www.yageo.com/documents/recent/PYu-RC_Group_51_RoHS_L_7.pdf; ComponentLink1Description: http://www.yageo.com/documents/recent/PYu-RC_Group_51_RoHS_L_7.pdf; Value: 0R; Supplier 1: Digi-Key; Supplier Part Number 1: 311-0.0NCT-ND; Stock 1: 6252381; Pricing 1: 1=0,10000, 10=0,03700, 25=0,02680, 50=0,02020, 100=0,01500, 250=0,01140, 500=0,00912, 1000=0,00672, 5000=0,00482 (USD); RoHS: Yes; Case/Package: 0201; Case Code (Metric): 0603; Case Code (Imperial): 0201; Weight: 6E-06oz; Contact Plating: Tin,Matte; Size Code: 0201; Min Operating Temperature: -55°C; Max Operating Temperature: 125°C; Packaging: Tape and Reel; Resistance: 0R; Package Quantity: 1; Resistor Type: Thick Film; Number of Terminations: 2; Termination: SMD/SMT; Max Power Dissipation: 50mW; Voltage Rating (DC): 25V; Features: Moisture Resistant; Series: RC; Construction: Rectangular; Resistance Tolerance: 5%; Length: 0.024inch; Width: 0.012inch; Height: 0.01inch; Depth: 0.3mm; Radiation Hardening: No; Military Standard: Not; Lead Free: Lead Free; RoHS Compliant: Yes; ComponentLink2URL: https://datasheet.ciiva.com/7672/1563626-7672248.pdf?src-supplier=Element14; ComponentLink2Description: https://datasheet.ciiva.com/7672/1563626-7672248.pdf?src-supplier=Element14; ComponentLink3URL: https://datasheet.ciiva.com/7672/1563626-7672247.pdf?src-supplier=Element14; ComponentLink3Description: https://datasheet.ciiva.com/7672/1563626-7672247.pdf?src-supplier=Element14; ComponentLink4URL: https://datasheet.ciiva.com/7660/1421516-7660808.pdf?src-supplier=Element14; ComponentLink4Description: https://datasheet.ciiva.com/7660/1421516-7660808.pdf?src-supplier=Element14; ComponentLink5URL: https://datasheet.ciiva.com/46391/1421516-46391340.pdf?src-supplier=Element14; ComponentLink5Description: https://datasheet.ciiva.com/46391/1421516-46391340.pdf?src-supplier=Element14
R120-R127 R140 R141 R148 R149 = Res_0402: Manufacturer: Yageo; Manufacturer Part Number 1: RC0201FR-073K3L; Part Description: 3.3 kOhms ±1% 0.05W, 1/20W Chip Resistor 0201 (0603 Metric) Moisture Resistant Thick Film; Max Power Dissipation: 50mW; Resistance: 3.3kR; Temperature Coefficient: 200ppm/°C; Voltage Rating: 25V; ComponentLink1URL: http://www.yageo.com/documents/recent/PYu-RC_Group_51_RoHS_L_7.pdf; ComponentLink1Description: http://www.yageo.com/documents/recent/PYu-RC_Group_51_RoHS_L_7.pdf; ComponentLink2URL: https://datasheet.ciiva.com/22698/1563626-22698524.pdf?src-supplier=Element14; ComponentLink2Description: https://datasheet.ciiva.com/22698/1563626-22698524.pdf?src-supplier=Element14; ComponentLink3URL: https://datasheet.ciiva.com/14985/pyu-r-int-thick-7-14985418.pdf?src-supplier=Digi-Key; ComponentLink3Description: https://datasheet.ciiva.com/14985/pyu-r-int-thick-7-14985418.pdf?src-supplier=Digi-Key; ComponentLink4URL: https://datasheet.ciiva.com/46391/1421516-46391339.pdf?src-supplier=Element14; ComponentLink4Description: https://datasheet.ciiva.com/46391/1421516-46391339.pdf?src-supplier=Element14; ComponentLink5URL: https://datasheet.ciiva.com/2467/pyu-r-int-thick-7-2467110.pdf?src-supplier=Digi-Key; ComponentLink5Description: https://datasheet.ciiva.com/2467/pyu-r-int-thick-7-2467110.pdf?src-supplier=Digi-Key; ComponentLink6URL: https://datasheet.ciiva.com/2467/pyu-r-int-thick-7-2467111.pdf?src-supplier=Digi-Key; ComponentLink6Description: https://datasheet.ciiva.com/2467/pyu-r-int-thick-7-2467111.pdf?src-supplier=Digi-Key; ComponentLink7URL: https://datasheet.ciiva.com/2467/pyu-r-int-thick-7-2467109.pdf?src-supplier=Digi-Key; ComponentLink7Description: https://datasheet.ciiva.com/2467/pyu-r-int-thick-7-2467109.pdf?src-supplier=Digi-Key; Case/Package: 0201; Case Code (Imperial): 0201; Case Code (Metric): 0603; Construction: Rectangular; Depth: 0.3mm; Features: Moisture Resistant; Height: 0.01inch; Length: 0.024inch; Max Operating Temperature: 125°C; Military Standard: Not; Min Operating Temperature: -55°C; Number of Terminations: 2; Package Quantity: 10000; Packaging: Tape and Reel; Power Rating: 50mW; Pricing 1: 1=0,10000, 10=0,03700, 100=0,01500, 1000=0,00672, 2500=0,00583, 5000=0,00482 (USD); Resistance Tolerance: 1%; Resistor Type: Thick Film; RoHS: Yes; RoHS Compliant: Yes; Series: RC; Stock 1: 586100; Supplier 1: Digi-Key; Supplier Part Number 1: YAG2285CT-ND; Termination: SMD/SMT; Tolerance: 1%; Value: 3k3, 1%; Width: 0.3mm
R132 R137 R145 = Res_0402: Part Description: 330 Ohms ±1% 0.05W, 1/20W Chip Resistor 0201 (0603 Metric) Thick Film; Manufacturer: Vishay Dale; Manufacturer Part Number 1: CRCW0201330RFKED; Power Rating: 50mW; Voltage Rating: 30V; Temperature Coefficient: 100ppm/°C; Value: 330R, 1%; Supplier 1: Digi-Key; Supplier Part Number 1: 541-330AABCT-ND; Stock 1: 245078; Pricing 1: 1=0,27000, 10=0,23000, 100=0,08990, 1000=0,03762, 2500=0,03448, 5000=0,03135 (USD); RoHS: Yes; Case/Package: 0201; Weight: 6E-06oz; Case Code (Imperial): 0201; Case Code (Metric): 0603; Contact Plating: Tin; Size Code: 0201; Min Operating Temperature: -55°C; Max Operating Temperature: 155°C; Resistance: 330R; Tolerance: 1%; Packaging: Tape and Reel; Package Quantity: 1; Resistor Type: Thick Film; Number of Terminations: 2; Max Power Dissipation: 50mW; Series: CRCW; Construction: Rectangular; Length: 0.6mm; Width: 0.3mm; Height: 0.011inch; Depth: 0.3mm; Radiation Hardening: No; Military Standard: Not; Lead Free: Lead Free; RoHS Compliant: Yes; ComponentLink1URL: https://datasheet.ciiva.com/8944/crcw0201e3-8944937.pdf?src-supplier=Avnet; ComponentLink1Description: https://datasheet.ciiva.com/8944/crcw0201e3-8944937.pdf?src-supplier=Avnet; ComponentLink2URL: https://datasheet.ciiva.com/2473/crcw0201e3-2473436.pdf?src-supplier=Digi-Key; ComponentLink2Description: https://datasheet.ciiva.com/2473/crcw0201e3-2473436.pdf?src-supplier=Digi-Key; ComponentLink3URL: https://datasheet.ciiva.com/2473/crcw0201e3-2473437.pdf?src-supplier=Digi-Key; ComponentLink3Description: https://datasheet.ciiva.com/2473/crcw0201e3-2473437.pdf?src-supplier=Digi-Key; ComponentLink4URL: https://datasheet.ciiva.com/2473/crcw0201e3-2473438.pdf?src-supplier=Digi-Key; ComponentLink4Description: https://datasheet.ciiva.com/2473/crcw0201e3-2473438.pdf?src-supplier=Digi-Key; ComponentLink5URL: https://datasheet.ciiva.com/16394/dcrcwe3-16394575.pdf?src-supplier=Future+Electronics; ComponentLink5Description: https://datasheet.ciiva.com/16394/dcrcwe3-16394575.pdf?src-supplier=Future+Electronics
R135 R150 = Res_0402: Manufacturer: Yageo; Manufacturer Part Number 1: RC0201FR-07100KL; Part Description: 100 kOhms ±1% 0.05W, 1/20W Chip Resistor 0201 (0603 Metric) Moisture Resistant Thick Film; Resistance: 100kR; Power Rating: 50mW; Voltage Rating: 25V; Temperature Coefficient: 200ppm/°C; Value: 100k, 1%; ComponentLink1URL: https://datasheet.ciiva.com/7672/1563626-7672204.pdf?src-supplier=Element14; ComponentLink1Description: https://datasheet.ciiva.com/7672/1563626-7672204.pdf?src-supplier=Element14; ComponentLink2URL: https://datasheet.ciiva.com/22698/1563626-22698505.pdf?src-supplier=Element14; ComponentLink2Description: https://datasheet.ciiva.com/22698/1563626-22698505.pdf?src-supplier=Element14; ComponentLink3URL: https://datasheet.ciiva.com/29721/pyu-r-int-thick-7-29721196.pdf?src-supplier=Digi-Key; ComponentLink3Description: https://datasheet.ciiva.com/29721/pyu-r-int-thick-7-29721196.pdf?src-supplier=Digi-Key; ComponentLink4URL: https://datasheet.ciiva.com/29721/pyu-r-int-thick-7-29721195.pdf?src-supplier=Digi-Key; ComponentLink4Description: https://datasheet.ciiva.com/29721/pyu-r-int-thick-7-29721195.pdf?src-supplier=Digi-Key; ComponentLink5URL: https://datasheet.ciiva.com/8896/pyu-rc0201-51-rohs-l-8-8896174.pdf?src-supplier=Avnet; ComponentLink5Description: https://datasheet.ciiva.com/8896/pyu-rc0201-51-rohs-l-8-8896174.pdf?src-supplier=Avnet; Supplier 1: Digi-Key; Supplier Part Number 1: 311-100KMCT-ND; Stock 1: 6001055; Pricing 1: 1=0,10000, 10=0,03700, 100=0,01500, 1000=0,00672, 2500=0,00583, 5000=0,00482 (USD); RoHS: Yes; Case/Package: 0201; Number of Pins: 2; Case Code (Imperial): 0201; Case Code (Metric): 0603; Contact Plating: Tin,Matte; Size Code: 0201; Min Operating Temperature: -55°C; Max Operating Temperature: 125°C; Tolerance: 1%; Packaging: Tape and Reel; Package Quantity: 10000; Termination: SMD/SMT; Resistor Type: Thick Film; Number of Terminations: 2; Max Power Dissipation: 50mW; Voltage Rating (DC): 25V; Features: Moisture Resistant; Series: RC; Resistance Tolerance: 1%; Construction: Rectangular; Length: 0.024inch; Width: 0.012inch; Height: 0.01inch; Depth: 0.3mm; Reach SVHC Compliant: Yes; Military Standard: Not; Lead Free: Lead Free; RoHS Compliant: Yes; ComponentLink6URL: https://datasheet.ciiva.com/7660/1421516-7660806.pdf?src-supplier=Element14; ComponentLink6Description: https://datasheet.ciiva.com/7660/1421516-7660806.pdf?src-supplier=Element14; ComponentLink7URL: https://datasheet.ciiva.com/22698/1563626-22698495.pdf?src-supplier=Element14; ComponentLink7Description: https://datasheet.ciiva.com/22698/1563626-22698495.pdf?src-supplier=Element14; ComponentLink8URL: https://datasheet.ciiva.com/46391/1421516-46391338.pdf?src-supplier=Element14; ComponentLink8Description: https://datasheet.ciiva.com/46391/1421516-46391338.pdf?src-supplier=Element14; ComponentLink9URL: https://datasheet.ciiva.com/2493/pyu-r-int-thick-7-2493770.pdf?src-supplier=Digi-Key; ComponentLink9Description: https://datasheet.ciiva.com/2493/pyu-r-int-thick-7-2493770.pdf?src-supplier=Digi-Key; ComponentLink10URL: https://datasheet.ciiva.com/2493/pyu-r-int-thick-7-2493771.pdf?src-supplier=Digi-Key; ComponentLink10Description: https://datasheet.ciiva.com/2493/pyu-r-int-thick-7-2493771.pdf?src-supplier=Digi-Key; ComponentLink11URL: https://datasheet.ciiva.com/2493/pyu-r-int-thick-7-2493769.pdf?src-supplier=Digi-Key; ComponentLink11Description: https://datasheet.ciiva.com/2493/pyu-r-int-thick-7-2493769.pdf?src-supplier=Digi-Key; ComponentLink12URL: https://datasheet.ciiva.com/26829/getdatasheetpartid-420441-26829850.pdf?src-supplier=Verical; ComponentLink12Description: https://datasheet.ciiva.com/26829/getdatasheetpartid-420441-26829850.pdf?src-supplier=Verical
VT1 VT2 = DMG1012T: Manufacturer: Diodes Incorporated; Manufacturer Part Number 1: DMG1012TQ-7; Part Description: N-Channel 20V 630mA (Ta) 280mW (Ta) Surface Mount SOT-523; FET Type: N-Channel; Current - Continuous Drain (Id) @ 25°C: 630mA (Ta); Drive Voltage (Max Rds On,  Min Rds On): 1.8V, 4.5V; Rds On (Max) @ Id, Vgs: 400 mOhm @ 600mA, 4.5V; Vgs(th) (Max) @ Id: 1V @ 250µA; Vgs (Max): ±6V; Power Dissipation (Max): 280mW (Ta); Supplier 1: Digi-Key; RoHS: RoHS Compliant; Category: Discrete Semiconductor Products; Stock 1: 3569; Pricing 1: 1=0.47, 10=0.424, 100=0.2375, 500=0.12722, 1000=0.08651 (USD); Packaging: Cut Tape (CT); Part Status: Active; Technology: MOSFET (Metal Oxide); FET Feature: -; Operating Temperature: -55°C ~ 150°C (TJ); Mounting Type: Surface Mount; Supplier Device Package: SOT-523; Package / Case: SOT-523; ComponentLink1URL: https://www.diodes.com/assets/Datasheets/ds31783.pdf; ComponentLink1Description: https://www.diodes.com/assets/Datasheets/ds31783.pdf; Supplier Part Number 1: DMG1012TQ-7DICT-ND
X5 = RF_IF_connector: CONN UMC RCPT STR 50 OHM SMD; Manufacturer: Molex, LLC; Manufacturer Part Number 1: 0734120110; Part Description: Ultra Miniature Coaxial Connector Receptacle, Male Pin 50 Ohm Surface Mount Solder; Body Finish: Nickel; Body Material: Phosphor Bronze; Center Contact Material: Brass; Center Contact Plating: Gold; Connector Style: Ultra Miniature Coaxial; Connector Type: Jack, Male Pin; Contact Termination: Solder; Dielectric Material: Liquid Crystal Polymer (LCP); Frequency - Max: 6GHz; Impedance: 50 Ohm; Voltage Rating: 60V; Cable Group: -; Category: Connectors, Interconnects; Fastening Type: Snap-On; Features: -; Housing Color: Silver; Ingress Protection: -; Mounting Type: Surface Mount; Operating Temperature: -40°C ~ 90°C; Packaging: Cut Tape (CT); RoHS: RoHS Compliant; Shield Termination: Solder; Supplier 1: Digi-Key; Supplier Part Number 1: WM5587CT-ND
X6 = Molex_0788641001_spring_contacts: Header, 6-pin; Part Description: 6 Position Spring Battery Contact Connector Surface Mount; Manufacturer Part Number 1: 78864-1001; Voltage Rating: 10V; Number of Contacts: 6; Glow Wire Compliant: Non-compliant; Supplier 1: Digi-Key; Supplier Part Number 1: WM11204CT-ND; Manufacturer: Molex; Stock 1: 133097; Pricing 1: 1=0,45000, 10=0,36500, 100=0,26730, 1000=0,21263 (USD); RoHS: Yes; Contact Material: Copper Alloy; Orientation: Vertical; Voltage Rating (DC): 10V; Number of Circuits: 6; Halogen Free: Low Halogen; ComponentLink1URL: http://www.farnell.com/datasheets/2216617.pdf?src-supplier=Farnell; ComponentLink1Description: http://www.farnell.com/datasheets/2216617.pdf?src-supplier=Farnell; ComponentLink2URL: http://www.farnell.com/datasheets/2216617.pdf?src-supplier=Newark; ComponentLink2Description: http://www.farnell.com/datasheets/2216617.pdf?src-supplier=Newark; ComponentLink3URL: http://www.farnell.com/datasheets/1862322.pdf?src-supplier=Element14; ComponentLink3Description: http://www.farnell.com/datasheets/1862322.pdf?src-supplier=Element14
X10 = PCIe_MiniCard_fingers: PCIe MiniCard full or half size

## Sheet 11_Power.SchDoc: Power
size A3; Organization: Lime Microsystems; Address1: Surrey Tech Centre; Address2: Guildford GU2 7YG; Address3: Surrey; Address4: United Kingdom; Revision: v1.1; SheetNumber: 11; SheetTotal: 11
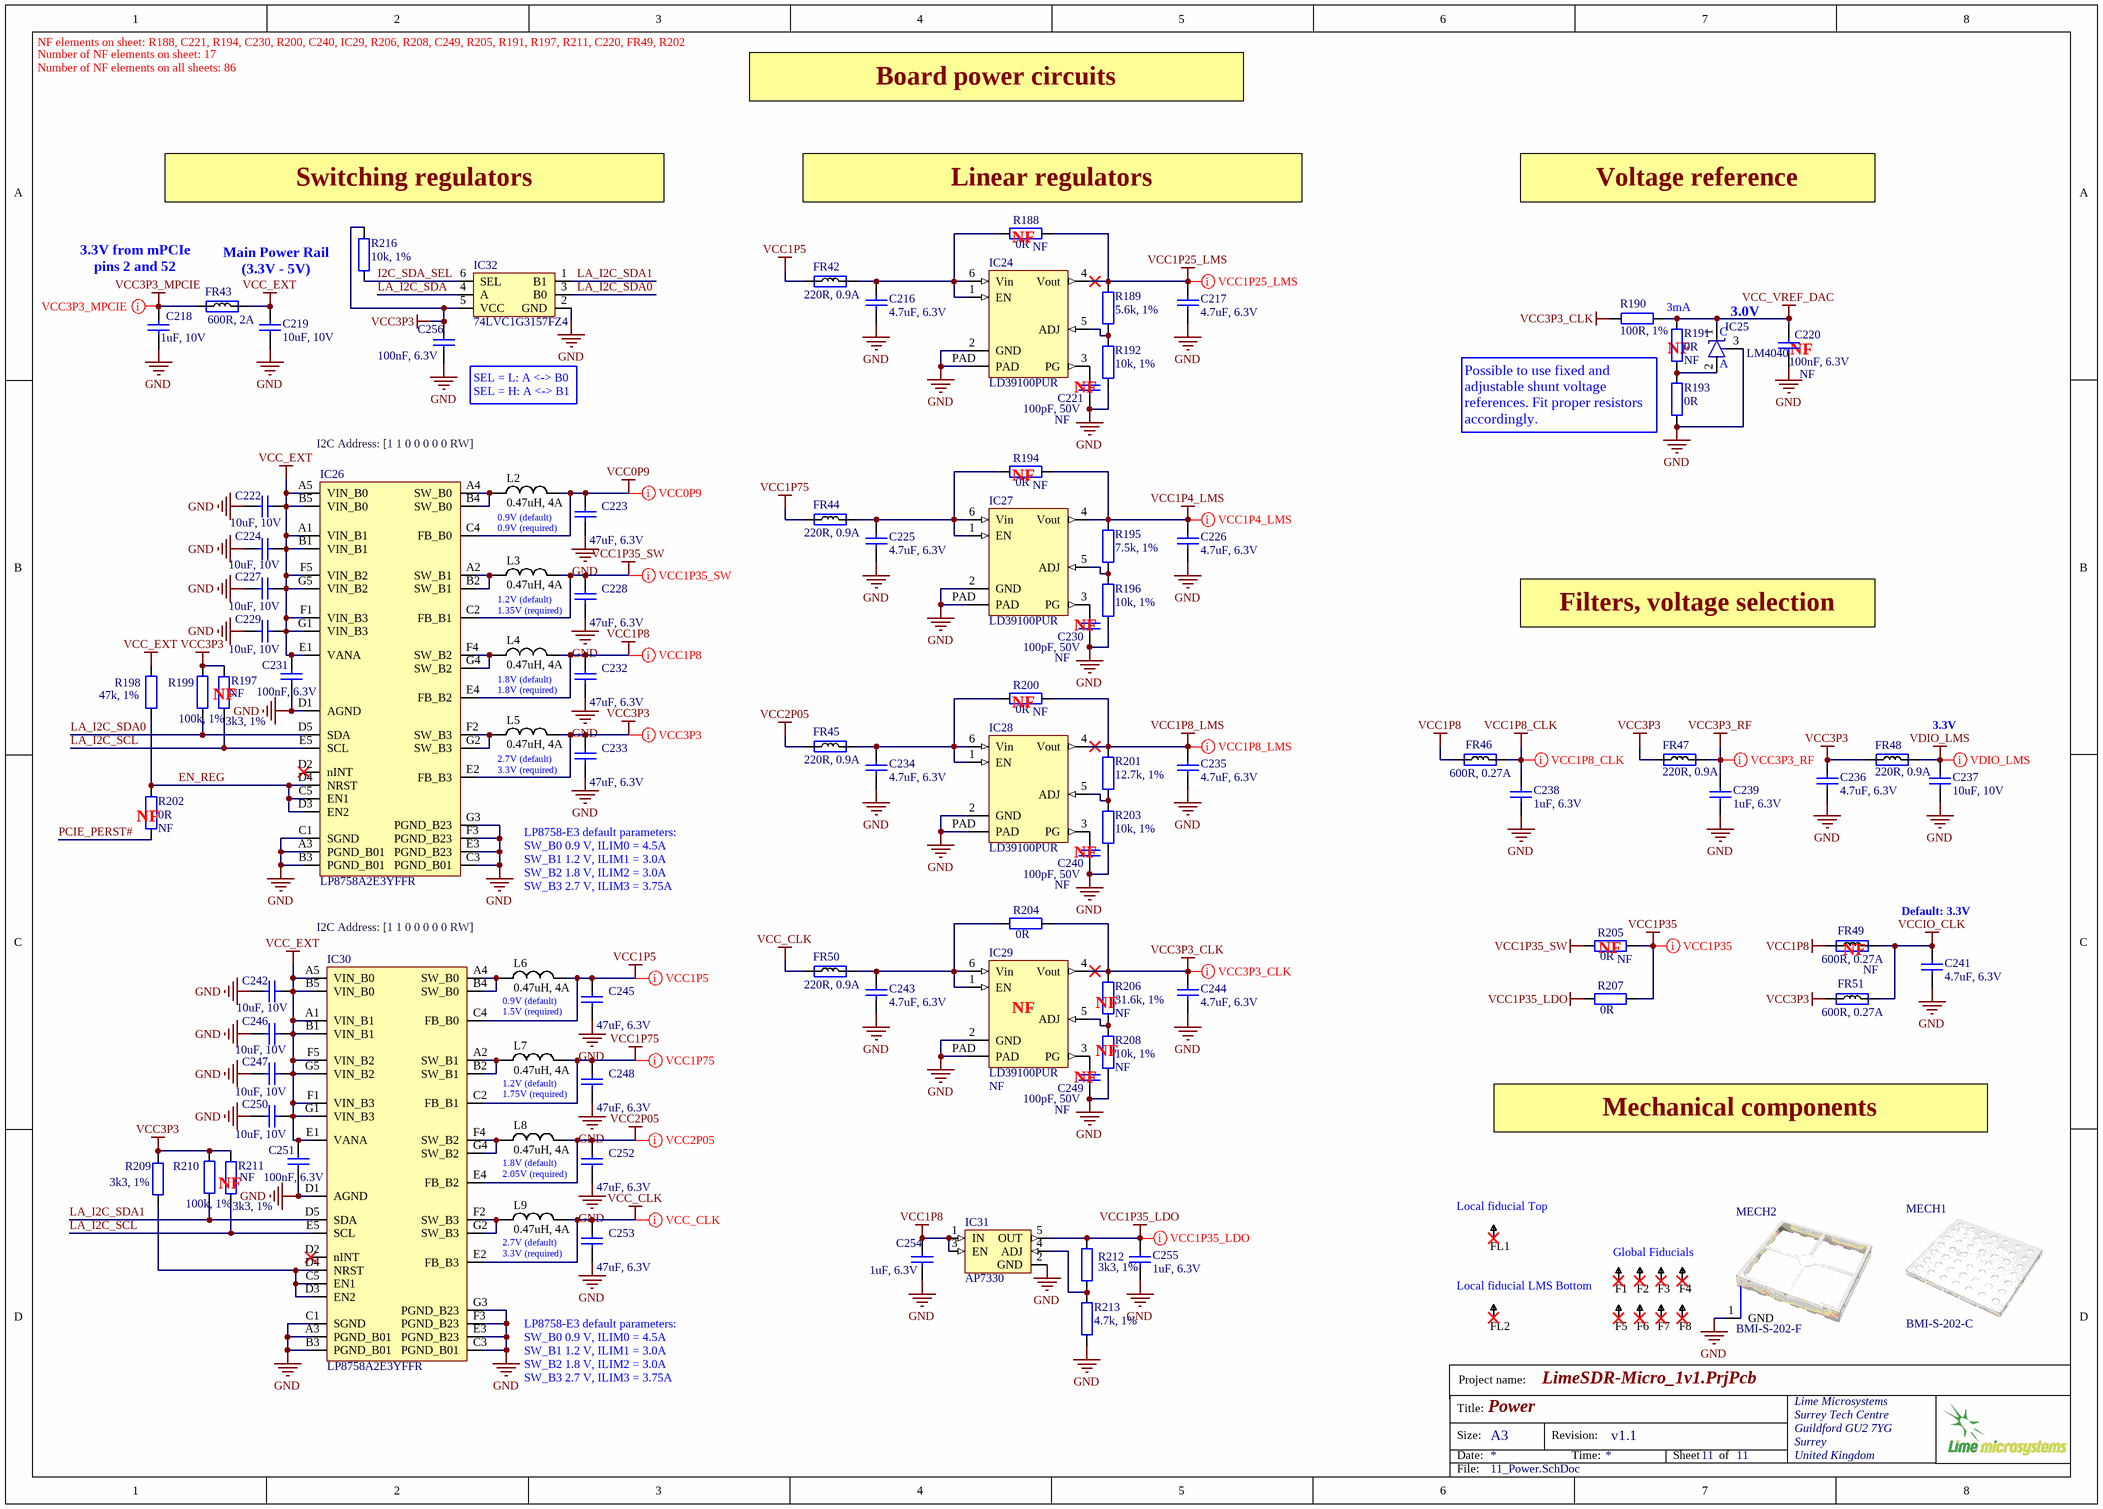
[diagram p2: 11_Power.SchDoc]

### Parts
C216  4.7uF, 6.3V  [CAP0402]
C217  4.7uF, 6.3V  [CAP0402]
C218  1uF, 10V  [CAP0402]
C219  10uF, 10V  [CAP0603]
C220  100nF, 6.3V  Assembly Info: NF  [CAP0201]
C221  100pF, 50V  Assembly Info: NF  [CAP0201]
C222  10uF, 10V  [CAP0603]
C223  47uF, 6.3V  [CAP0603]
C224  10uF, 10V  [CAP0603]
C225  4.7uF, 6.3V  [CAP0402]
C226  4.7uF, 6.3V  [CAP0402]
C227  10uF, 10V  [CAP0603]
C228  47uF, 6.3V  [CAP0603]
C229  10uF, 10V  [CAP0603]
C230  100pF, 50V  Assembly Info: NF  [CAP0201]
C231  100nF, 6.3V  [CAP0201]
C232  47uF, 6.3V  [CAP0603]
C233  47uF, 6.3V  [CAP0603]
C234  4.7uF, 6.3V  [CAP0402]
C235  4.7uF, 6.3V  [CAP0402]
C236  4.7uF, 6.3V  [CAP0402]
C237  10uF, 10V  [CAP0603]
C238  1uF, 6.3V  [CAP0201]
C239  1uF, 6.3V  [CAP0201]
C240  100pF, 50V  Assembly Info: NF  [CAP0201]
C241  4.7uF, 6.3V  [CAP0402]
C242  10uF, 10V  [CAP0603]
C243  4.7uF, 6.3V  [CAP0402]
C244  4.7uF, 6.3V  [CAP0402]
C245  47uF, 6.3V  [CAP0603]
C246  10uF, 10V  [CAP0603]
C247  10uF, 10V  [CAP0603]
C248  47uF, 6.3V  [CAP0603]
C249  100pF, 50V  Assembly Info: NF  [CAP0201]
C250  10uF, 10V  [CAP0603]
C251  100nF, 6.3V  [CAP0201]
C252  47uF, 6.3V  [CAP0603]
C253  47uF, 6.3V  [CAP0603]
C254  1uF, 6.3V  [CAP0201]
C255  1uF, 6.3V  [CAP0201]
C256  100nF, 6.3V  [CAP0201]
F1  Fiducial  [Fiducial]  (value not drawn)
F2  Fiducial  [Fiducial]  (value not drawn)
F3  Fiducial  [Fiducial]  (value not drawn)
F4  Fiducial  [Fiducial]  (value not drawn)
F5  Fiducial  [Fiducial]  (value not drawn)
F6  Fiducial  [Fiducial]  (value not drawn)
F7  Fiducial  [Fiducial]  (value not drawn)
F8  Fiducial  [Fiducial]  (value not drawn)
FL1  Fiducial  [Fiducial_local]  (value not drawn)
FL2  Fiducial  [Fiducial_local]  (value not drawn)
FR42  220R, 0.9A  [RES0402]
FR43  600R, 2A  [RES0805]
FR44  220R, 0.9A  [RES0402]
FR45  220R, 0.9A  [RES0402]
FR46  600R, 0.27A  [RES0201]
FR47  220R, 0.9A  [RES0402]
FR48  220R, 0.9A  [RES0402]
FR49  Assembly Info: NF  [RES0201]  (hidden comment: 600R, 0.27A)
FR50  220R, 0.9A  [RES0402]
FR51  600R, 0.27A  [RES0201]
IC24  LD39100PUR  [LD39100PUR]
IC25  LM4040  [SOT23-3_v3]
IC26  LP8758A2E3YFFR  [LP8758A1E0YFFR_QUAD_DC-DC_35DSBGA]
IC27  LD39100PUR  [LD39100PUR]
IC28  LD39100PUR  [LD39100PUR]
IC29  LD39100PUR  Assembly Info: NF  [LD39100PUR]
IC30  LP8758A2E3YFFR  [LP8758A1E0YFFR_QUAD_DC-DC_35DSBGA]
IC31  AP7330  [AP7330-W5-7_SOT25]
IC32  74LVC1G3157FZ4  [74LVC1G3157FZ4_SPDT_SW_DFN1410-6]
L2  0.47uH, 4A  [IND0806]
L3  0.47uH, 4A  [IND0806]
L4  0.47uH, 4A  [IND0806]
L5  0.47uH, 4A  [IND0806]
L6  0.47uH, 4A  [IND0806]
L7  0.47uH, 4A  [IND0806]
L8  0.47uH, 4A  [IND0806]
L9  0.47uH, 4A  [IND0806]
MECH1  BMI-S-202-C  [BMI-S-202-C_RF_SHIELD_COVER]
MECH2  BMI-S-202-F  [BMI-S-202-F_RF_SHIELD_FRAME_v3]
R188  0R  Assembly Info: NF  [RES0201]
R189  5.6k, 1%  [RES0201]
R190  100R, 1%  [RES0201]
R191  0R  Assembly Info: NF  [RES0201]
R192  10k, 1%  [RES0201]
R193  0R  [RES0201]
R194  0R  Assembly Info: NF  [RES0201]
R195  7.5k, 1%  [RES0201]
R196  10k, 1%  [RES0201]
R197  3k3, 1%  Assembly Info: NF  [RES0201]
R198  47k, 1%  [RES0201]
R199  100k, 1%  [RES0201]
R200  0R  Assembly Info: NF  [RES0201]
R201  12.7k, 1%  [RES0201]
R202  0R  Assembly Info: NF  [RES0201]
R203  10k, 1%  [RES0201]
R204  0R  [RES0201]
R205  0R  Assembly Info: NF  [RES0201]
R206  31.6k, 1%  Assembly Info: NF  [RES0201]
R207  0R  [RES0201]
R208  10k, 1%  Assembly Info: NF  [RES0201]
R209  3k3, 1%  [RES0201]
R210  100k, 1%  [RES0201]
R211  3k3, 1%  Assembly Info: NF  [RES0201]
R212  3k3, 1%  [RES0201]
R213  4.7k, 1%  [RES0201]
R216  10k, 1%  [RES0201]

### Nets
GND: C216.1 C217.1 C218.1 C219.1 C220.2 C221.1 C222.1 C223.1 C224.1 C225.1 C226.1 C227.1 C228.1 C229.1 C230.1 C231.2 C232.1 C233.1 C234.1 C235.1 C236.1 C237.1 C238.2 C239.2 C240.1 C241.1 C242.1 C243.1 C244.1 C245.1 C246.1 C247.1 C248.1 C249.1 C250.1 C251.2 C252.1 C253.1 C254.2 C255.2 C256.2 IC24.2(GND) IC24.PAD IC25.3(NC/A) IC26.A3(PGND_B01) IC26.B3(PGND_B01) IC26.C1(SGND) IC26.C3(PGND_B01) IC26.D1(AGND) IC26.E3(PGND_B23) IC26.F3(PGND_B23) IC26.G3(PGND_B23) IC27.2(GND) IC27.PAD IC28.2(GND) IC28.PAD IC29.2(GND) IC29.PAD IC30.A3(PGND_B01) IC30.B3(PGND_B01) IC30.C1(SGND) IC30.C3(PGND_B01) IC30.D1(AGND) IC30.E3(PGND_B23) IC30.F3(PGND_B23) IC30.G3(PGND_B23) IC31.2(GND) IC32.2(GND) MECH2.1(GND) R192.2 R193.2 R196.2 R203.2 R208.2 R213.2
VCC0P9: C223.2 IC26.C4(FB_B0) L2.2
VCC1P4_LMS: C226.2 IC27.4(Vout) R194.2 R195.1
VCC1P5: C245.2 FR42.1 IC30.C4(FB_B0) L6.2
VCC1P8: C232.2 C254.1 FR46.1 FR49.1 IC26.E4(FB_B2) IC31.1(IN) IC31.3(EN) L4.2
VCC1P8_CLK: C238.1 FR46.2
VCC1P8_LMS: C235.2 IC28.4(Vout) R200.2 R201.1
VCC1P25_LMS: C217.2 IC24.4(Vout) R188.2 R189.1
VCC1P35: R205.2 R207.2
VCC1P35_LDO: C255.1 IC31.5(OUT) R207.1 R212.1
VCC1P35_SW: C228.2 IC26.C2(FB_B1) L3.2 R205.1
VCC1P75: C248.2 FR44.1 IC30.C2(FB_B1) L7.2
VCC2P05: C252.2 FR45.1 IC30.E4(FB_B2) L8.2
VCC3P3: C233.2 C236.2 C256.1 FR47.1 FR48.1 FR51.1 IC26.E2(FB_B3) IC32.5(VCC) L5.2 R197.1 R199.1 R209.1 R210.1 R211.1 R216.2
VCC3P3_CLK: C244.2 IC29.4(Vout) R190.2 R204.2 R206.1
VCC3P3_MPCIE: C218.2 FR43.1
VCC3P3_RF: C239.1 FR47.2
VCC_CLK: C253.2 FR50.1 IC30.E2(FB_B3) L9.2
VCC_EXT: C219.2 C222.2 C224.2 C227.2 C229.2 C231.1 C242.2 C246.2 C247.2 C250.2 C251.1 FR43.2 IC26.A1(VIN_B1) IC26.A5(VIN_B0) IC26.B1(VIN_B1) IC26.B5(VIN_B0) IC26.E1(VANA) IC26.F1(VIN_B3) IC26.F5(VIN_B2) IC26.G1(VIN_B3) IC26.G5(VIN_B2) IC30.A1(VIN_B1) IC30.A5(VIN_B0) IC30.B1(VIN_B1) IC30.B5(VIN_B0) IC30.E1(VANA) IC30.F1(VIN_B3) IC30.F5(VIN_B2) IC30.G1(VIN_B3) IC30.G5(VIN_B2) R198.1
VCC_VREF_DAC: C220.1 IC25.1(K) R190.1 R191.1
VCCIO_CLK: C241.2 FR49.2 FR51.2
VDIO_LMS: C237.2 FR48.2
EN_REG: IC26.C5(EN1) IC26.D3(EN2) IC26.D4(NRST) R198.2 R202.2
I2C_SDA_SEL: IC32.6(SEL) R216.1
LA_I2C_SCL: IC26.E5(SCL) IC30.E5(SCL) R197.2 R211.2
LA_I2C_SDA: IC32.4(A)
LA_I2C_SDA0: IC26.D5(SDA) IC32.3(B0) R199.2
LA_I2C_SDA1: IC30.D5(SDA) IC32.1(B1) R210.2
PCIE_PERST#: R202.1
NetC216_2: C216.2 FR42.2 IC24.1(EN) IC24.6(Vin) R188.1
NetC221_2: C221.2 IC24.3(PG)
NetC225_2: C225.2 FR44.2 IC27.1(EN) IC27.6(Vin) R194.1
NetC230_2: C230.2 IC27.3(PG)
NetC234_2: C234.2 FR45.2 IC28.1(EN) IC28.6(Vin) R200.1
NetC240_2: C240.2 IC28.3(PG)
NetC243_2: C243.2 FR50.2 IC29.1(EN) IC29.6(Vin) R204.1
NetC249_2: C249.2 IC29.3(PG)
NetIC24_5: IC24.5(ADJ) R189.2 R192.1
NetIC25_2: IC25.2(A) R191.2 R193.1
NetIC26_A2: IC26.A2(SW_B1) IC26.B2(SW_B1) L3.1
NetIC26_A4: IC26.A4(SW_B0) IC26.B4(SW_B0) L2.1
NetIC26_F2: IC26.F2(SW_B3) IC26.G2(SW_B3) L5.1
NetIC26_F4: IC26.F4(SW_B2) IC26.G4(SW_B2) L4.1
NetIC27_5: IC27.5(ADJ) R195.2 R196.1
NetIC28_5: IC28.5(ADJ) R201.2 R203.1
NetIC29_5: IC29.5(ADJ) R206.2 R208.1
NetIC30_A2: IC30.A2(SW_B1) IC30.B2(SW_B1) L7.1
NetIC30_A4: IC30.A4(SW_B0) IC30.B4(SW_B0) L6.1
NetIC30_C5: IC30.C5(EN1) IC30.D3(EN2) IC30.D4(NRST) R209.2
NetIC30_F2: IC30.F2(SW_B3) IC30.G2(SW_B3) L9.1
NetIC30_F4: IC30.F4(SW_B2) IC30.G4(SW_B2) L8.1
NetIC31_4: IC31.4(ADJ) R212.2 R213.1

Not connected (* = marked no-connect by the designer): F1 1*; F2 1*; F3 1*; F4 1*; F5 1*; F6 1*; F7 1*; F8 1*; FL1 1*; FL2 1*; IC26 D2(nINT)*; IC30 D2(nINT)*